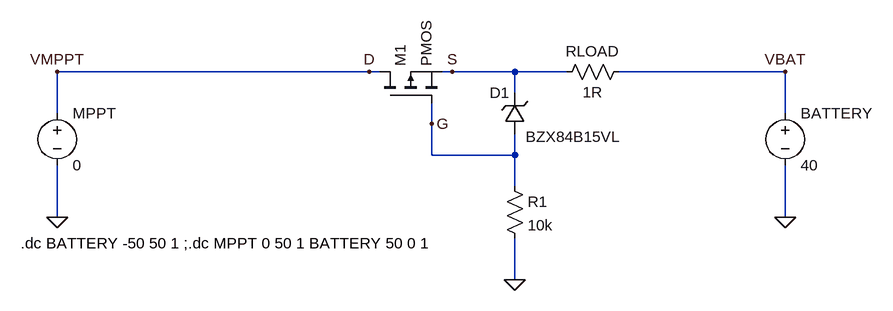
[diagram p0: schematic OutputReversePolarityProtection.asc]
OutputReversePolarityProtection.asc, the LTspice schematic file:
Version 4
SHEET 1 880 680
WIRE 96 112 -384 112
WIRE 112 112 96 112
WIRE 224 112 208 112
WIRE 320 112 224 112
WIRE 400 112 320 112
WIRE 736 112 480 112
WIRE 320 144 320 112
WIRE -384 176 -384 112
WIRE 736 176 736 112
WIRE 192 192 192 160
WIRE 192 240 192 192
WIRE 320 240 320 208
WIRE 320 240 192 240
WIRE 320 288 320 240
WIRE -384 336 -384 256
WIRE 736 336 736 256
WIRE 320 432 320 368
FLAG -384 336 0
FLAG 736 336 0
FLAG 320 432 0
FLAG -384 112 VMPPT
FLAG 736 112 VBAT
FLAG 192 192 G
FLAG 224 112 S
FLAG 96 112 D
SYMBOL pmos 112 160 R270
SYMATTR InstName M1
SYMBOL voltage -384 160 R0
WINDOW 123 0 0 Left 0
WINDOW 39 0 0 Left 0
SYMATTR InstName MPPT
SYMATTR Value 0
SYMBOL voltage 736 160 R0
SYMATTR InstName BATTERY
SYMATTR Value 40
SYMBOL res 304 272 R0
SYMATTR InstName R1
SYMATTR Value 10k
SYMBOL res 496 96 R90
WINDOW 0 0 56 VBottom 2
WINDOW 3 32 56 VTop 2
SYMATTR InstName RLOAD
SYMATTR Value 1R
SYMBOL zener 336 208 R180
WINDOW 0 24 64 Left 2
WINDOW 3 -146 -4 Left 2
SYMATTR InstName D1
SYMATTR Value BZX84B15VL
TEXT -440 376 Left 2 !.dc BATTERY -50 50 1 ;.dc MPPT 0 50 1 BATTERY 50 0 1

The netlist it stands for:
* OutputReversePolarityProtection.asc
M1 D G S S PMOS
V§MPPT D 0 0
V§BATTERY VBAT 0 40
R1 G 0 10k
RLOAD VBAT S 1R
D1 G S BZX84B15VL
.model D D
.lib standard.dio
.model NMOS NMOS
.model PMOS PMOS
.lib standard.mos
.dc BATTERY -50 50 1 ;.dc MPPT 0 50 1 BATTERY 50 0 1
.backanno
.end